# Altium schematic sheet Display.SchDoc
size A4; SheetNumber: 33; SheetTotal: 36
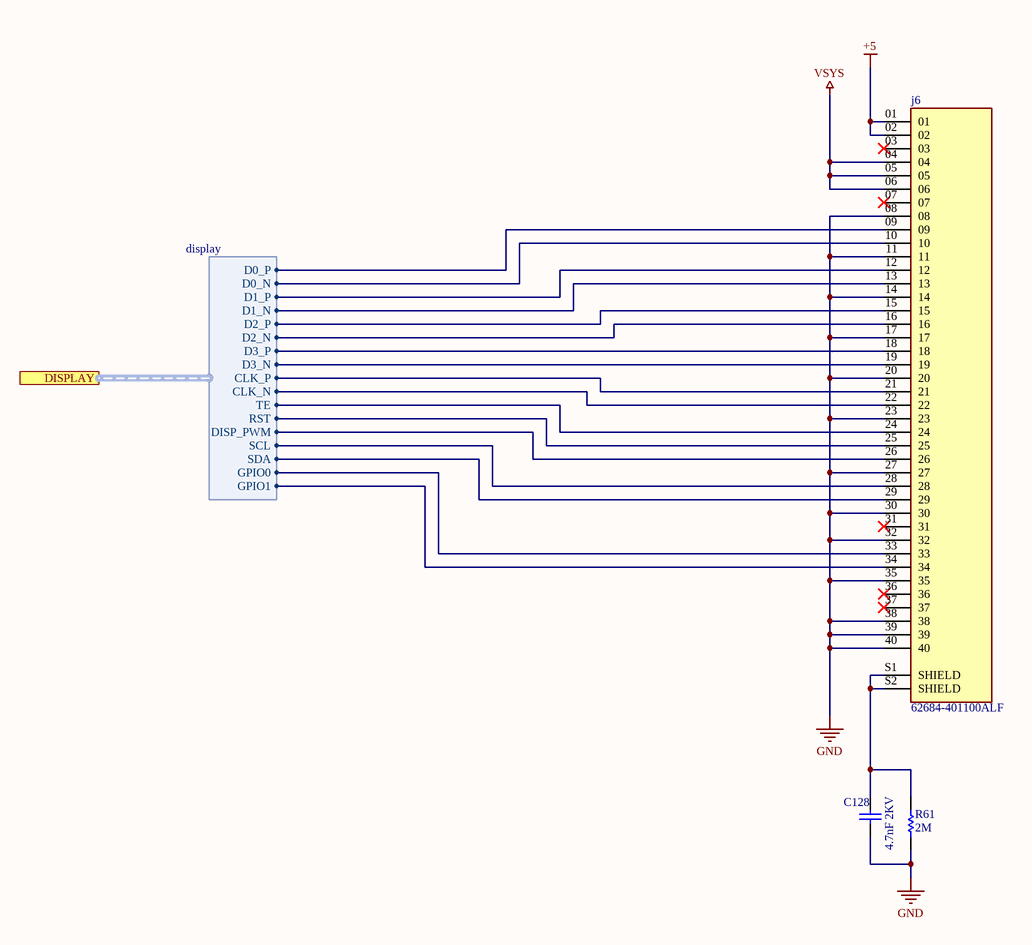
[diagram p0: Display.SchDoc]

## Parts
C128  value 4.7nF 2KV  [C1210]  (hidden comment: C1210)
j6  62684-401100ALF  [AMPHENOL_62684-401100ALF]
R61  value 2M  [R0603]  (hidden comment: R0603)

## Ports
DISPLAY (harness display, see main[9100,8000], MT8365[6900,9000], MT8365_CONN[1400,3100])

## Harnesses
display: D0_P, D0_N, D1_P, D1_N, D2_P, D2_N, D3_P, D3_N, CLK_P, CLK_N, TE, RST, DISP_PWM, SCL, SDA, GPIO0, GPIO1

## Nets
+5: j6.01 j6.02
GND: C128.1 j6.08 j6.11 j6.14 j6.17 j6.20 j6.23 j6.27 j6.30 j6.32 j6.35 j6.38 j6.39 j6.40 R61.2
VSYS: j6.04 j6.05 j6.06
NetC128_2: C128.2 j6.S1(SHIELD) j6.S2(SHIELD) R61.1
Netj6_09: j6.09 ; port DISPLAY.D0_P
Netj6_10: j6.10 ; port DISPLAY.D0_N
Netj6_12: j6.12 ; port DISPLAY.D1_P
Netj6_13: j6.13 ; port DISPLAY.D1_N
Netj6_15: j6.15 ; port DISPLAY.D2_P
Netj6_16: j6.16 ; port DISPLAY.D2_N
Netj6_18: j6.18 ; port DISPLAY.D3_P
Netj6_19: j6.19 ; port DISPLAY.D3_N
Netj6_21: j6.21 ; port DISPLAY.CLK_P
Netj6_22: j6.22 ; port DISPLAY.CLK_N
Netj6_24: j6.24 ; port DISPLAY.TE
Netj6_25: j6.25 ; port DISPLAY.RST
Netj6_26: j6.26 ; port DISPLAY.DISP_PWM
Netj6_28: j6.28 ; port DISPLAY.SCL
Netj6_29: j6.29 ; port DISPLAY.SDA
Netj6_33: j6.33 ; port DISPLAY.GPIO0
Netj6_34: j6.34 ; port DISPLAY.GPIO1

Not connected (* = marked no-connect by the designer): j6 03* 07* 31* 36* 37*